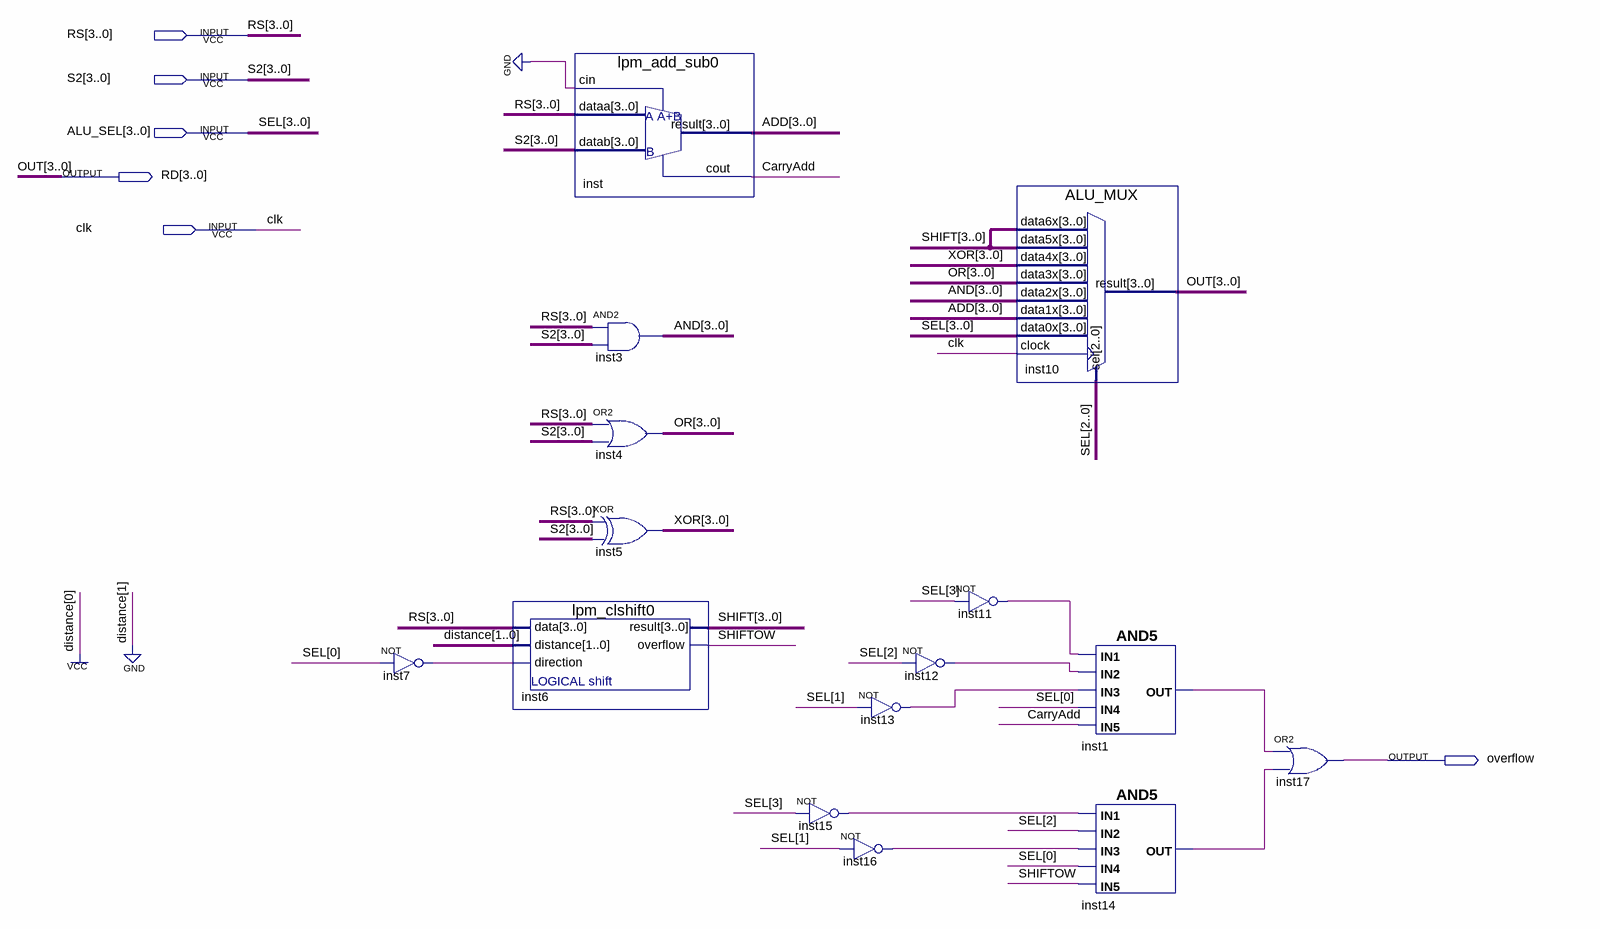
[diagram p0: schematic sheet]
// Quartus schematic ALU.bdf as structural Verilog: 15 symbols, 6 pins
module ALU (
  input  [3:0] RS,
  input  [3:0] S2,
  input  [3:0] ALU_SEL,
  input  clk,
  output [3:0] RD,
  output overflow
);

  wire CarryAdd, inst1_out, inst7_out, inst11_out, inst12_out, inst13_out, inst14_out, inst15_out,
       inst16_out, SHIFTOW;
  wire [3:0] ADD, AND, OR, SHIFT, XOR;

  not inst7 (inst7_out, ALU_SEL[0]);
  lpm_add_sub0 inst (.cin(1'b0), .dataa(RS), .datab(S2), .result(ADD), .cout(CarryAdd));
  lpm_clshift0 inst6 (.data(RS), .distance(2'b01), .direction(inst7_out), .result(SHIFT), .overflow(SHIFTOW));
  assign AND = RS & S2;  // AND2 inst3, 4 bits wide
  assign OR = RS | S2;  // OR2 inst4, 4 bits wide
  assign XOR = RS ^ S2;  // XOR inst5, 4 bits wide
  not inst13 (inst13_out, ALU_SEL[1]);
  not inst15 (inst15_out, ALU_SEL[3]);
  not inst16 (inst16_out, ALU_SEL[1]);
  not inst12 (inst12_out, ALU_SEL[2]);
  not inst11 (inst11_out, ALU_SEL[3]);
  ALU_MUX inst10 (
    .data6x(SHIFT), .data5x(SHIFT), .data4x(XOR), .data3x(OR), .data2x(AND), .data1x(ADD), .data0x(ALU_SEL),
    .clock(clk), .sel(ALU_SEL[2:0]), .result(RD));
  and inst1 (inst1_out, inst11_out, inst12_out, inst13_out, ALU_SEL[0], CarryAdd);
  and inst14 (inst14_out, inst15_out, ALU_SEL[2], inst16_out, ALU_SEL[0], SHIFTOW);
  or inst17 (overflow, inst1_out, inst14_out);

  // Other names for the same wires on the sheet: OUT[3:0] = RD; SEL[3:0] = ALU_SEL
endmodule
